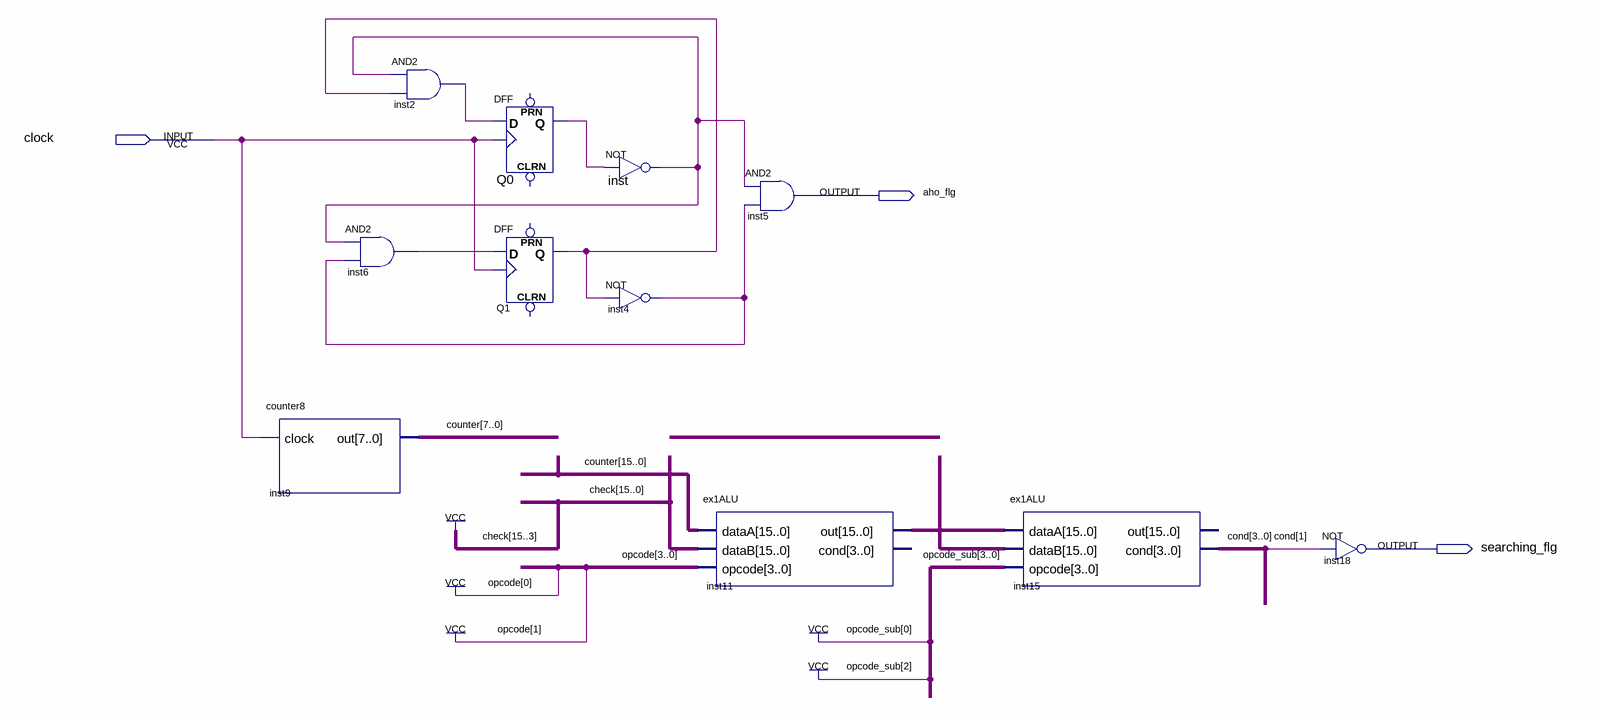
[diagram p0: schematic sheet]
// Quartus schematic ex2circuit_fail.bdf as structural Verilog: 11 symbols, 3 pins
module ex2circuit_fail (
  input  clock,
  output aho_flg,
  output searching_flg
);

  wire inst2_out, inst4_out, inst6_out, inst_out, Q0_q, Q1_q;
  wire [2:0] check;
  wire [3:0] cond;
  wire [3:1] opcode_sub;
  wire [3:2] opcode;
  wire [15:0] counter, inst11_out, undriven;

  counter8 inst9 (.clock(clock), .out(counter[7:0]));
  and inst2 (inst2_out, inst_out, Q1_q);
  and inst6 (inst6_out, inst_out, inst4_out);
  DFF Q0 (.CLK(clock), .D(inst2_out), .Q(Q0_q));  // open: CLRN, PRN
  DFF Q1 (.CLK(clock), .D(inst6_out), .Q(Q1_q));  // open: CLRN, PRN
  not inst (inst_out, Q0_q);
  not inst4 (inst4_out, Q1_q);
  ex1ALU inst11 (
    .dataA(counter), .dataB({{13{1'b1}}, check}), .opcode({opcode, 2'b11}), .out(inst11_out));  // open: cond
  and inst5 (aho_flg, inst_out, inst4_out);
  ex1ALU inst15 (
    .dataA(inst11_out), .dataB(undriven), .opcode({opcode_sub[3], 1'b1, opcode_sub[1], 1'b1}), .cond(cond));  // open: out
  not inst18 (searching_flg, cond[1]);
endmodule
